# Altium schematic sheet BuckRegulatorOnSer.SchDoc
size 381 x 241 mm; SheetNumber: 2; SheetTotal: 6
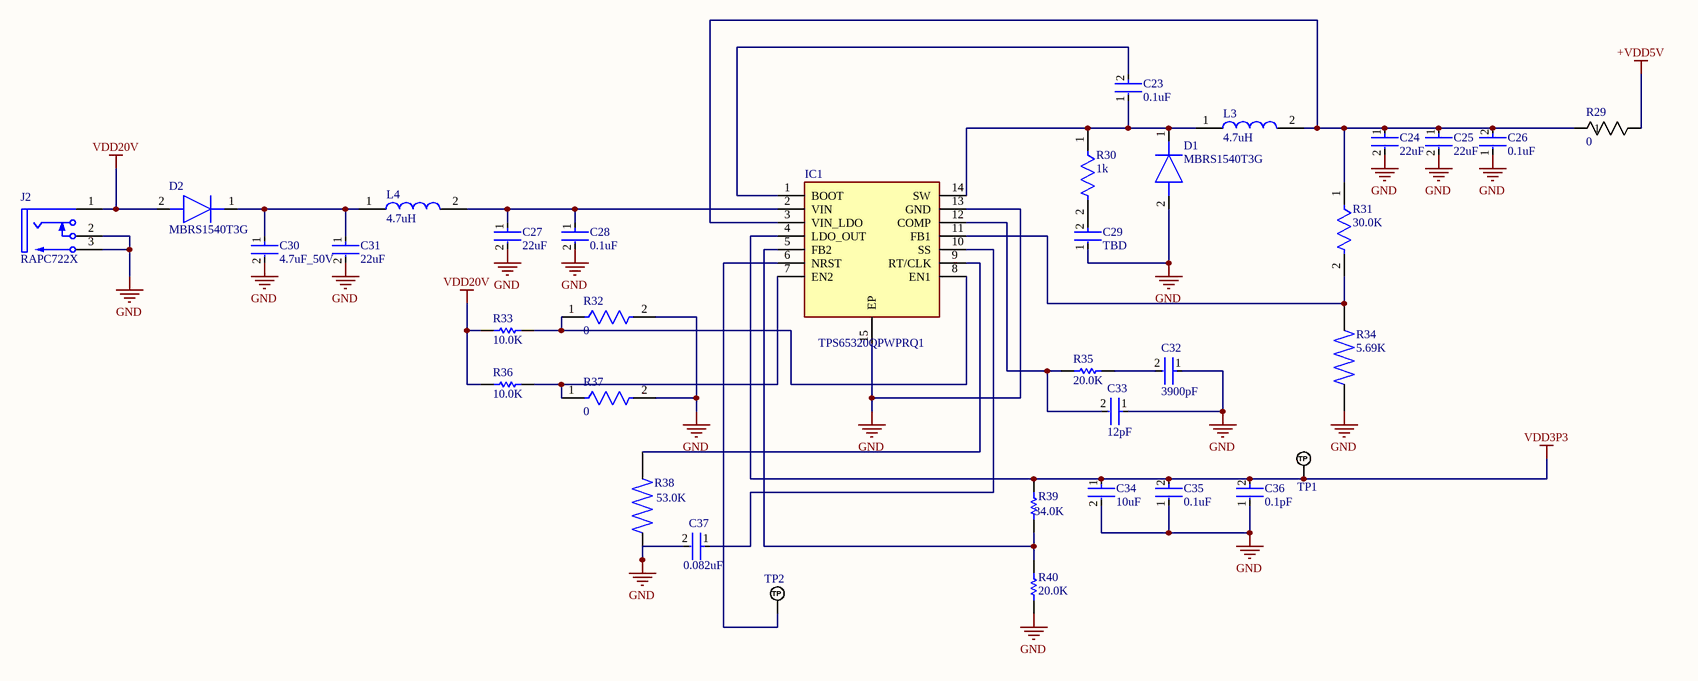
[diagram p0: BuckRegulatorOnSer.SchDoc]

## Parts
C23  0.1uF  [FP-GRM15-MFG]
C24  22uF  [FP-C3216-160-0_2-IPC_B]
C25  22uF  [FP-C3216-160-0_2-IPC_B]
C26  0.1uF  [FP-GRM15-MFG]
C27  22uF  [FP-C3216-160-0_2-IPC_B]
C28  0.1uF  [FP-GRM188-0_1-e0_2_0_5-IPC_B]
C29  TBD  [FP-GRM15-MFG]
C30  4.7uF_50V  [FP-C3216-160-0_2-IPC_B]
C31  22uF  [FP-C3216-160-0_2-IPC_B]
C32  3900pF  [FP-C0402-BB-MFG]
C33  12pF  [FP-C0402-BB-MFG]
C34  10uF  [FP-C2012-125-0_2-MFG]
C35  0.1uF  [FP-GRM15-MFG]
C36  0.1pF  [FP-GRM15-MFG]
C37  0.082uF  [FP-C0402-BB-MFG]
D1  MBRS1540T3G  [DIOM5436X256N]
D2  MBRS1540T3G  [DIOM5436X256N]
IC1  TPS65320QPWPRQ1  [SOP65P640X120-15N]
J2  RAPC722X  [SWITCH-RAPC712X-3_V]
L3  4.7uH  [XFL4020472MEB]
L4  4.7uH  [XFL4020472MEB]
R29  0  [RC2512N_VIS]
R30  1k  [FP-CRCW0603-e3-MFG]
R31  30.0K  [FP-ERJ3EK-IPC_A]
R32  0  [FP-ERJ-3GEY0R00V-MFG]
R33  10.0K  [RESC1609X55X30LL15T15]
R34  5.69K  [RESC1608X46N]
R35  20.0K  [RESC1608X55X30ML15T15]
R36  10.0K  [RESC1609X55X30LL15T15]
R37  0  [FP-ERJ-3GEY0R00V-MFG]
R38  53.0K  [RESC1608X46N]
R39  34.0K  [RESC1608X55X30ML15T15]
R40  20.0K  [RESC1608X55X30ML15T15]
TP1  TP_NOBOM  [PAD_RND_1MM]  (value not drawn)  (no BOM)
TP2  TP_NOBOM  [PAD_RND_1MM]  (value not drawn)  (no BOM)

## Nets
+VDD5V: R29.2
GND: C24.2 C25.2 C26.1 C27.2 C28.2 C29.1 C30.2 C31.2 C32.1 C33.1 C34.2 C35.1 C36.1 C37.2 D1.2(A) IC1.13(GND) IC1.15(EP) J2.2 J2.3 R32.2 R34.2 R37.2 R38.2 R40.2
VDD3P3: C34.1 C35.2 C36.2 IC1.4(LDO_OUT) R39.1 TP1.1(TP)
VDD20V: D2.2(A) J2.1 R33.1 R36.1
NetC23_1: C23.1 D1.1(K) IC1.14(SW) L3.1 R30.1
NetC23_2: C23.2 IC1.1(BOOT)
NetC24_1: C24.1 C25.1 C26.2 IC1.3(VIN_LDO) L3.2 R29.1 R31.1
NetC27_1: C27.1 C28.1 IC1.2(VIN) L4.2
NetC29_2: C29.2 R30.2
NetC30_1: C30.1 C31.1 D2.1(K) L4.1
NetC32_2: C32.2 R35.2
NetC33_2: C33.2 IC1.12(COMP) R35.1
NetC37_1: C37.1 IC1.10(SS)
NetIC1_5: IC1.5(FB2) R39.2 R40.1
NetIC1_6: IC1.6(NRST) TP2.1(TP)
NetIC1_7: IC1.7(EN2) R36.2 R37.1
NetIC1_8: IC1.8(EN1) R32.1 R33.2
NetIC1_9: IC1.9(RT/CLK) R38.1
NetIC1_11: IC1.11(FB1) R31.2 R34.1

## Library data of the parts
C23 C26 C29 C35 C36 = CMP-2100-03641-2: CAP CER 0.1UF 16V X7R 0402; Manufacturer Part Number: GRM155R71C104KA88D; Manufacturer: Murata; Standoff Height: 0mm; Tolerance: 10%; Voltage Rating: 16Vdc; Material: Ceramic; Capacitance: 0.10μF; Value: 0.10μF; RoHS: TRUE; Temperature Characteristic: X7R; Octopart: https://octopart.com/grm155r71c104ka88d-murata-196880; Digikey Description: CAP CER 0.1UF 16V X7R 0402; Device Class L3: Ceramic Capacitors; Height: 0.55mm; ComponentLink2Description: Datasheet; Temperature Range Low: -55°C; Ipc Land Pattern Name: CAPC10050X219; ComponentLink2URL: https://search.murata.co.jp/Ceramy/image/img/A01X/G101/ENG/GRM155R71H471KA01-01A.pdf; Device Class L1: Passive Components; Lead Free: yes; Category: Cap; Package: GRM15; Temperature: -55°C to +125°C; Device Class L2: Capacitors; Temperature Range High: +125°C; Mouser Description: 0402 0.1 uF 16V ±10 % Tolerance X7R SMT Multilayer Ceramic Capacitor
C24 C25 C27 C31 = CMP-08246-004697-1: Multilayer Ceramic Capacitors 22uF ±20% 25V X5R SMD 1206; RoHS Compliant: Yes; Thickness: 0.071inch; Mount: Surface Mount; Termination: SMD/SMT; Height: 1.6mm; Resistor Type: Ceramic; REACH SVHC: No SVHC; Packaging: Tape and Reel; Construction: Flat; Depth: 1.6mm; Lead Free: Lead Free; Tolerance: 20%; Width: 0.063inch; Capacitance: 22uF; Weight: 0.000571oz; Case Code (Imperial): 1206; Case/Package: 1206; Min Operating Temperature: -55°C; Package Quantity: 1; Voltage Rating (DC): 25V; Length: 3.2mm; Voltage Rating: 25V; Case Code (Metric): 3216; Dielectric: X5R; Series: C; Dielectric Material: Ceramic; Max Operating Temperature: 85°C
C28 = CMP-1035-02595-8: Chip Multilayer Ceramic Capacitors for General Purpose, 0603, 0.10uF, X7R, 15%, 10%, 100V; Capacitance: 100nF; Voltage Rating (DC): 100V; Material: Ceramic; Packaging: Tape and Reel; Dielectric: X7R; Case Code (Imperial): 0603; Package Quantity: 1; Height: 0.8mm; Weight: 0.000222oz; Min Operating Temperature: -55°C; Depth: 0.8mm; Mount: Surface Mount; Thickness: 0.035inch; Voltage: 100V; REACH SVHC: No SVHC; Case/Package: 0603; Voltage Rating: 100V; Width: 0.8mm; Tolerance: 10%; Lead Free: Lead Free; Case Code (Metric): 1608; Radiation Hardening: No; Max Operating Temperature: 125°C; Termination: SMD/SMT; Length: 1.6mm
C30 = CMP-08246-002892-1: Multilayer Ceramic Capacitors 4.7uF ±20% 50V X7R SMD 1206; Depth: 1.6mm; Radiation Hardening: No; Length: 3.2mm; Dielectric: X7R; RoHS Compliant: Yes; Packaging: Tape and Reel; Voltage Rating: 50V; Voltage Rating (DC): 50V; Min Operating Temperature: -55°C; Resistor Type: Ceramic; Lead Free: Lead Free; Case/Package: 1206; Dielectric Material: Ceramic; Max Operating Temperature: 125°C; Series: C; Width: 0.063inch; Height: 1.6mm; Weight: 0.000571oz; Thickness: 1.6mm; Capacitance: 4.7uF; Case Code (Imperial): 1206; Tolerance: 20%; Construction: Flat; Case Code (Metric): 3216; Termination: SMD/SMT; Mount: Surface Mount; Package Quantity: 1
C32 = CMP-1034-01791-3: CAP CER 3900PF 16V X7R 0402; Manufacturer Part Number: C0402C392K4RACTU; Manufacturer: Kemet; Value: 3,900 pF; Temperature Coefficient: 15%; Tolerance: 0.1; Material: Ceramic; Temperature Range High: +125°C; Automotive: No; Octopart: https://octopart.com/c0402c392k4ractu-kemet-12577363; RoHS: TRUE; Category: Cap; Temperature Range Low: -55°C; Device Class L1: Passive Components; Digikey Description: CAP CER 3900PF 16V X7R 0402; ComponentLink2Description: Datasheet; Voltage Rating: 16 V; Device Class L2: Capacitors; ComponentLink2URL: https://content.kemet.com/datasheets/KEM_C1002_X7R_SMD.pdf; Package: C0402-BB; Lead Free: Yes; Ipc Land Pattern Name: CAPC10050X50; Mouser Description: Multilayer Ceramic Capacitors MLCC - SMD/SMT 16volts 3900pF X7R 10%; Temperature Characteristic: X7R; Height: 0.55mm; Temperature: -55°C to +125°C; Device Class L3: Ceramic Capacitors; Capacitance: 3,900 pF
C33 = CMP-2008-03330-2: CAP CER 12PF 25V C0G/NP0 0402; Manufacturer Part Number: C0402C120J3GACAUTO; Manufacturer: Kemet; Material: Ceramic; Temperature Characteristic: C0G; Temperature Coefficient: 15%; Tolerance: 0.05; Temperature Range High: +125°C; ComponentLink2URL: https://content.kemet.com/datasheets/KEM_C1002_X7R_SMD.pdf; Lead Free: Yes; Device Class L2: Capacitors; Voltage Rating: 25 V; Device Class L1: Passive Components; Temperature Range Low: -55°C; Value: 12 pF; Automotive: No; Category: Cap; Height: 0.55mm; Octopart: https://octopart.com/c0402c120j3gacauto-kemet-21768529; Digikey Description: CAP CER 12PF 25V C0G/NP0 0402; Temperature: -55°C to +125°C; Device Class L3: Ceramic Capacitors; Package: C0402-BB; Capacitance: 12 pF; ComponentLink2Description: Datasheet; Ipc Land Pattern Name: CAPC10050X50; RoHS: TRUE
C34 = CMP-2000-05452-2: Multilayer Ceramic Capacitors 10μF ±10% 10V X7R SMD 0805; Series: C; Case/Package: 0805; REACH SVHC: No SVHC; Tolerance: 10%; Resistor Type: Ceramic; Termination: SMD/SMT; Weight: 0.000194oz; Depth: 1.25mm; Capacitance: 10uF; Construction: Flat; RoHS Compliant: Yes; Contact Plating: Tin; Packaging: Tape and Reel; Mount: Surface Mount; Thickness: 0.057inch; Radiation Hardening: No; Dielectric: X7R; Min Operating Temperature: -55°C; Voltage Rating (DC): 10V; Voltage: 10V; Width: 0.049inch; Package Quantity: 1; Number of Pins: 2; Height: 1.25mm; Max Operating Temperature: 125°C; Dielectric Material: Ceramic; Case Code (Imperial): 0805; Lead Free: Lead Free; Voltage Rating: 10V; Case Code (Metric): 2012; Length: 2mm
C37 = CMP-1034-02057-3: Multilayer Ceramic Capacitor, C Series, 0.082 - F, - 10%, X7r, 16 V, 0402 [1005 Metric] Rohs Compliant: Yes; Manufacturer: Kemet; Manufacturer Part Number: C0402C823K4RACTU; Capacitance: 82,000 pF; Voltage Rating: 16 V; Temperature Coefficient: 15%; Value: 82,000 pF; Tolerance: 0.1; Device Class L2: Capacitors; ComponentLink2Description: Datasheet; Category: Cap; Temperature Range High: +125°C; Height: 0.55mm; Lead Free: Yes; Octopart: https://octopart.com/c0402c823k4ractu-kemet-134782; Device Class L3: Ceramic Capacitors; Ipc Land Pattern Name: CAPC10050X50; Package: C0402-BB; Temperature Range Low: -55°C; Temperature: -55°C to +125°C; Mouser Description: Multilayer Ceramic Capacitors MLCC - SMD/SMT 16volts 82000pF X7R 10%; Material: Ceramic; ComponentLink2URL: https://content.kemet.com/datasheets/KEM_C1002_X7R_SMD.pdf; Device Class L1: Passive Components; RoHS: TRUE; Automotive: No; Temperature Characteristic: X7R; Digikey Description: Multilayer Ceramic Capacitor, C Series, 0.082 - F, - 10%, X7r, 16 V, 0402 [1005 Metric] Rohs Compliant: Yes
D1 D2 = MBRS1540T3G: Diode; Manufacturer_Name: onsemi; Datasheet Link: https://www.onsemi.com/pub/Collateral/MBRS1540T3-D.PDF; Height: 2.56mm; Manufacturer_Part_Number: MBRS1540T3G; Mouser Part Number: 863-MBRS1540T3G; Mouser Price/Stock: https://www.mouser.co.uk/ProductDetail/onsemi/MBRS1540T3G?qs=3JMERSakeboNHqMh%252BSYqYg%3D%3D; Arrow Part Number: MBRS1540T3G; Arrow Price/Stock: https://www.arrow.com/en/products/mbrs1540t3g/on-semiconductor?utm_currency=USD&region=europe
IC1 = TPS65320QPWPRQ1: Integrated Circuit; Manufacturer_Name: Texas Instruments; Datasheet Link: https://www.ti.com/general/docs/suppproductinfo.tsp?distId=10&gotoUrl=https%3A%2F%2Fwww.ti.com%2Flit%2Fgpn%2Ftps65320-q1; Height: 1.2mm; Manufacturer_Part_Number: TPS65320QPWPRQ1; Mouser Part Number: 595-TPS65320QPWPRQ1; Mouser Price/Stock: https://www.mouser.co.uk/ProductDetail/Texas-Instruments/TPS65320QPWPRQ1?qs=FBI%252BX3tnPf3UK2GiH7QeCQ%3D%3D; Arrow Part Number: TPS65320QPWPRQ1; Arrow Price/Stock: https://www.arrow.com/en/products/tps65320qpwprq1/texas-instruments
J2 = CMP-2000-05384-1: Power Jack, 5 A, 3-Pin THD, RoHS, Bulk; Manufacturer: Switchcraft; Current Rating: 5A; Plug/Mating Plug Diameter: 2.1mmID,5.5mmOD; Gender: Male; Mating Products: S765-ND / -CONNPLUGMINIPWR2CONDWHT/RED / S760K-ND / -CONNPOWERPLUGMINI.08"BLACK / SC1052-ND / -CONNPOWERPLUGMINIBLACK; Number of Positions/Contacts: 2Conductors,2Contacts; Internal Switch(s): SingleSwitch,NormallyClosed; Shielding: Unshielded; Catalog Drawings: RAPC7(1,2)2XSide / RAPC7(1,2)2XTop; Dynamic Catalog: SwitchcraftInc; Other Names: Q2287470A / RAPC722X-ND / SC1313; Standard Package: 2,500; Termination: SolderEyelet(s); Family: Barrel-PowerConnectors; Housing Color: Black; Housing Material: Thermoplastic; RoHS Information: SwitchcraftRoHSInfo; Color: Black; Contact Material - Plating: Nickel; Mounting Type: ThroughHole,RightAngle; Manufacturer URL: http://www.switchcraft.com/; Contact Material: Brass; Datasheet Version: Rev. A, 08/2005; Connector Type: Jack; Category: Connectors,Interconnects; Datasheet URL: http://www.mouser.com/ds/2/393/rapc722x_cd-371352.pdf
L3 L4 = XFL4020-472MEB: Inductor; Manufacturer_Name: COILCRAFT; Datasheet Link: https://componentsearchengine.com/Datasheets/1/XFL4020-472MEB.pdf; Height: 2.1mm; Manufacturer_Part_Number: XFL4020-472MEB; Mouser Part Number: 994-XFL4020-472MEB; Mouser Price/Stock: https://www.mouser.co.uk/ProductDetail/Coilcraft/XFL4020-472MEB?qs=VJjuEbE9QBPFBMgGchYEoQ%3D%3D
R29 = CRCW25120000Z0EGHP: CRCW2512-HP 0R0 E67 E3; Manufacturer_Name: Vishay; Copyright: Copyright (C) 2025 Ultra Librarian. All rights reserved.; Manufacturer_Part_Number: CRCW25120000Z0EGHP; Datasheet: https://www.vishay.com/doc?20043
R30 = CMP-1666-00003-5: RES Thick Film, 1kΩ, 1%, 0.1W, 100ppm/°C, 0603; Max Power Dissipation: 100mW; Voltage Rating: 75V; Resistance: 1kR; Max Operating Temperature: 155°C; Number of Pins: 2; Case Code (Imperial): 0603; Width: 0.033inch; Power Rating: 100mW; Number of Terminations: 2; Package Quantity: 10; Weight: 7.1E-05oz; Tolerance: 1%; Temperature Coefficient: 100ppm/°C; Military Standard: Not; Mount: Surface Mount; Voltage Rating (DC): 75V; Depth: 0.85mm; Composition: Thick Film; Radiation Hardening: No; Termination: SMD/SMT; Length: 1.55mm; Case Code (Metric): 1608; Contact Plating: Tin; Min Operating Temperature: -55°C; Packaging: Tape and Reel; Height: 0.45mm; Lead Free: Lead Free; Case/Package: 0603; Features: Automotive AEC-Q200
R31 = CMP-2000-00413-2: RES SMD 30K OHM 1% 1/10W 0603; Voltage Rating: 75V; Temperature Coefficient: 100ppm/°C; Max Power Dissipation: 100mW; Resistance: 30kR; Case Code (Imperial): 0603; Termination: SMD/SMT; Number of Terminations: 2; Series: ERJ; Features: Automotive AEC-Q200; Width: 0.031inch; Packaging: Tape and Reel; REACH SVHC: No SVHC; Lead Free: Lead Free; RoHS Compliant: Yes; Contact Plating: Tin; Case/Package: 0603; Tolerance: 1%; Mount: Surface Mount; Min Operating Temperature: -55°C; Resistor Type: Thick Film; Radiation Hardening: No; Resistance Tolerance: 1%; Construction: Rectangular; Power Rating: 100mW; Case Code (Metric): 1608; Size Code: 0603; Voltage Rating (DC): 75V; Military Standard: Not; Package Quantity: 1; Depth: 0.8mm; Length: 1.6mm; Height: 0.022inch; Max Operating Temperature: 155°C
R32 R37 = CMP-2000-00700-2: RES SMD 0 OHM JUMPER 1/10W 0603; Manufacturer Part Number: ERJ-3GEY0R00V; Manufacturer: Panasonic; Tolerance: 5%; Automotive Grade: Grade 0; Voltage Rating: 75V; Value: 0Ω; Temperature Coefficient: -100/+600ppm/°C; Power Rating: 0.1W; Mouser Description: Resistor, Chip Thick Film, 0 Ohm, 0.1w, Resistor, Chip Thick Film, 0 Ohm, 0.1w, 5%; Ipc Land Pattern Name: RESC16080X45; Category: Res; Package: 0603; Temperature: -55°C to +155°C; Temperature Range Low: -55°C; Series: ERJ; Resistance: 0Ω; RoHS: TRUE; Composition: Thick Film; Octopart: https://octopart.com/erj-3gey0r00v-panasonic-55389238; Device Class L1: Passive Components; Footprint Url: https://industrial.panasonic.com/cdbs/www-data/pdf/RDA0000/DMA0000COL17.pdf; ComponentLink2Description: Datasheet; Device Class L2: Resistors; Temperature Range High: +155°C; Digikey Description: RES SMD 0 OHM JUMPER 1/10W 0603; Lead Free: Yes; Device Class L3: Chip SMD Resistors; Height: 0.55mm; ComponentLink2URL: https://industrial.panasonic.com/cdbs/www-data/pdf/RDA0000/AOA0000C301.pdf; Automotive: Yes
R33 R36 = CMP-1012-00623-3: Chip Resistor, 10 KOhm, +/- 1%, 0.1 W, -55 to 155 degC, 0603 (1608 Metric), RoHS, Tape and Reel; Manufacturer: Panasonic; Voltage Rating: 75V; Case\/Package: 0603; Power Rating: 100mW; Resistance: 10KOhm; Temperature Coefficient: 100ppm\/degreesC; Number of Pins: 2; Package Reference: 603; Depth: 0.8mm; Mount: SurfaceMount; Package Description: 2-Pin Surface Mount Device, Body 1.6 x 0.85 mm; Datasheet Version: 02/2017; Length: 1.6mm; Lead Free: LeadFree; Height: 0.45mm; Number of Terminations: 2; Max Power Dissipation: 100mW; Min Operating Temperature: -55degC; Datasheet URL: https://industrial.panasonic.com/cdbs/www-data/pdf/RDA0000/AOA0000C304.pdf; Termination: SMD/SMT; Case Code (Metric): 1608; Case Code (Imperial): 0603; Tolerance: 1%; Max Operating Temperature: 155degC; RoHSCompliant: true; Voltage Rating (DC): 75V; Radiation Hardening: No; Packaging: TapeandReel; Composition: ThickFilm; Mounting Technology: SurfaceMount; Manufacturer URL: http://www.panasonic.com/; Width: 0.031inch; REACH SVHC: NoSVHC; Contact Plating: Tin; Military Standard: Not; Package Quantity: 1
R34 = PAT0603E5691BST1: Package: None; Price: None; Value: *; MP: PAT0603E5691BST1; Availability: Unavailable
R35 R40 = CMP-2000-00318-1: Part Number: ERJ-3EKF2002V; Manufacturer: Panasonic
R38 = PAT0603E5302BST1: Package: None; Price: None; Value: *; MP: PAT0603E5302BST1; Availability: Unavailable
R39 = CMP-2000-00447-1: Part Number: ERJ-3EKF3402V; Manufacturer: Panasonic
TP1 TP2 = TEST_POINT_RND_1MM: Test Point Round 1mm (NO BOM)